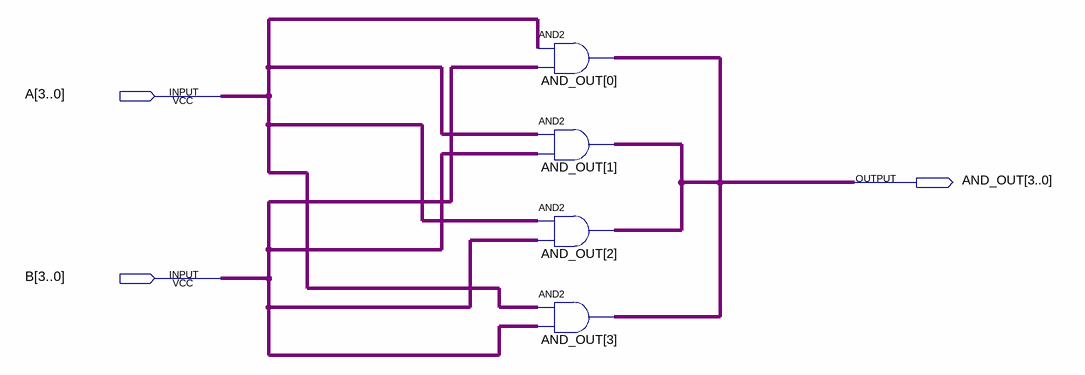
[diagram p0: schematic sheet]
// Quartus schematic and_unit.bdf as structural Verilog: 4 symbols, 3 pins
module and_unit (
  input  [3:0] A,
  input  [3:0] B,
  output [3:0] AND_OUT
);

  assign AND_OUT = A & B;  // AND2 AND_OUT[0], 4 bits wide
  assign AND_OUT = A & B;  // AND2 AND_OUT[1], 4 bits wide
  assign AND_OUT = A & B;  // AND2 AND_OUT[2], 4 bits wide
  assign AND_OUT = A & B;  // AND2 AND_OUT[3], 4 bits wide
endmodule
